# Altium schematic sheet FlashMemory.SchDoc
size A4; SheetNumber: 4; SheetTotal: 11
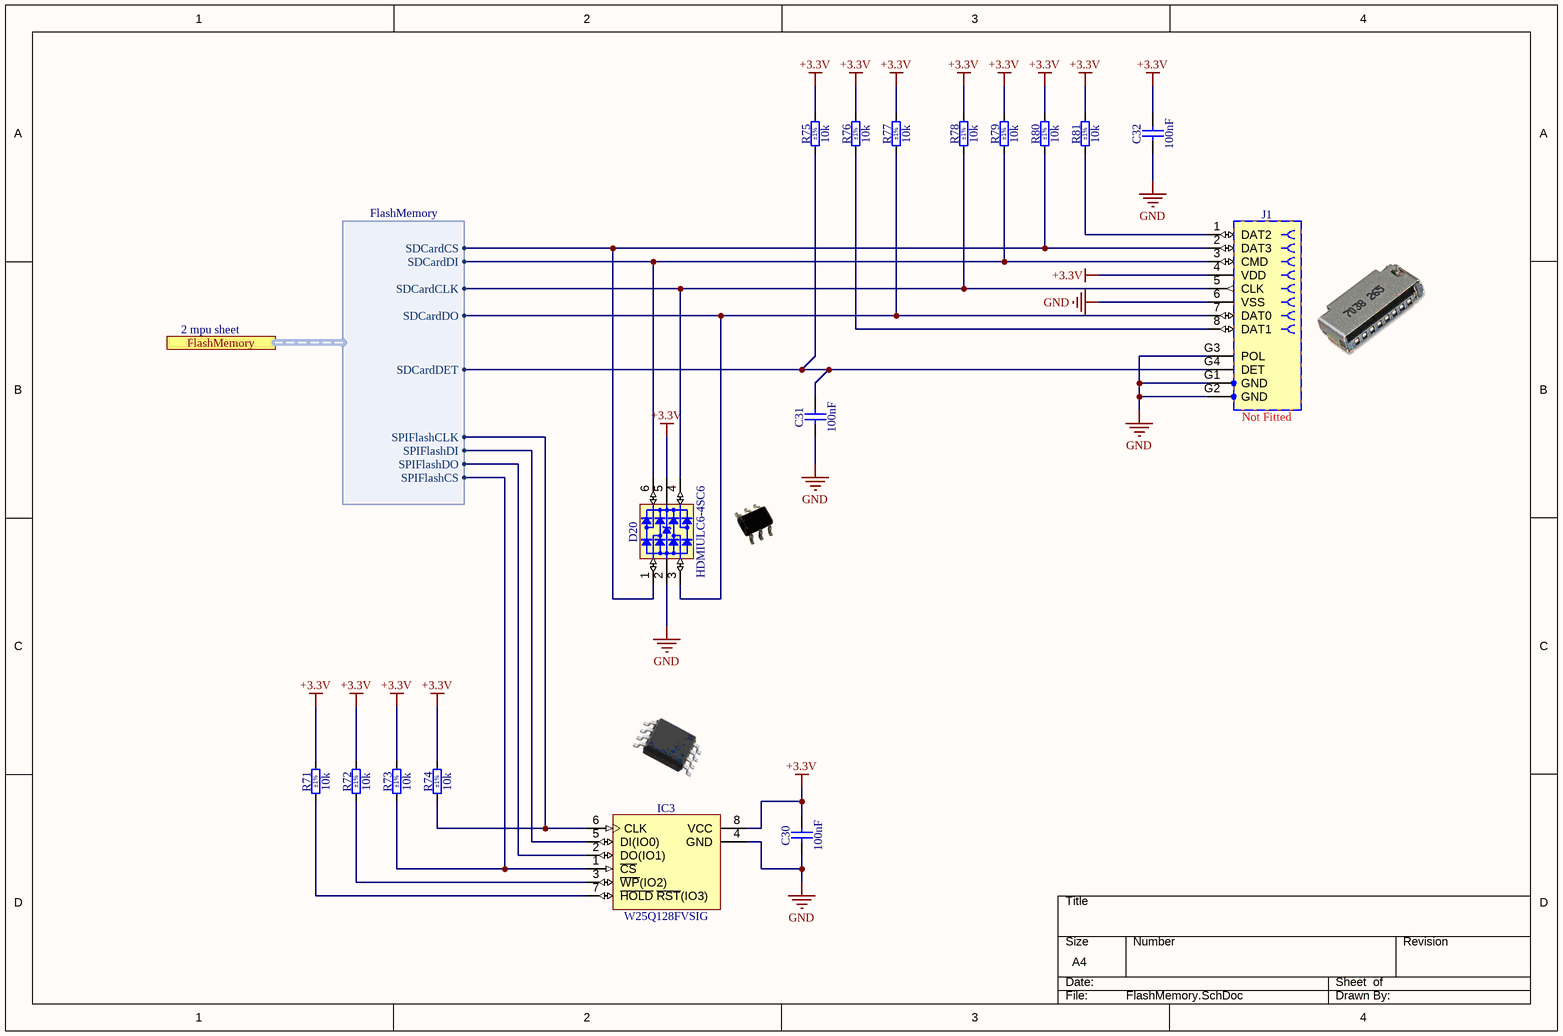
[diagram p0: FlashMemory.SchDoc]

## Parts
C30  100nF  [CAPC1608X87N]
C31  100nF  [CAPC1608X87N]
C32  100nF  [CAPC1608X87N]
D20  HDMIULC6-4SC6  [SOT95P280X145-6N]
IC3  W25Q128FVSIG  [SOIC127P790X216-8N]
J1  Not Fitted  [MOLEX_47309-2651]
R71  10k  Tolerance: ±1%  [RESC1608X55N]
R72  10k  Tolerance: ±1%  [RESC1608X55N]
R73  10k  Tolerance: ±1%  [RESC1608X55N]
R74  10k  Tolerance: ±1%  [RESC1608X55N]
R75  10k  Tolerance: ±1%  [RESC1608X55N]
R76  10k  Tolerance: ±1%  [RESC1608X55N]
R77  10k  Tolerance: ±1%  [RESC1608X55N]
R78  10k  Tolerance: ±1%  [RESC1608X55N]
R79  10k  Tolerance: ±1%  [RESC1608X55N]
R80  10k  Tolerance: ±1%  [RESC1608X55N]
R81  10k  Tolerance: ±1%  [RESC1608X55N]

## Ports
FlashMemory (harness FlashMemory)

## Harnesses
FlashMemory: SDCardDO, SDCardCLK, SDCardDI, SDCardCS, SPIFlashCS, SDCardDET, SPIFlashDO, SPIFlashDI, SPIFlashCLK

## Nets
+3.3V: C30.2 C32.2 D20.5(VBUS) IC3.8(VCC) J1.4(VDD) R71.2 R72.2 R73.2 R74.2 R75.2 R76.2 R77.2 R78.2 R79.2 R80.2 R81.2
GND: C30.1 C31.1 C32.1 D20.2(GND) IC3.4(GND) J1.6(VSS) J1.G1(GND) J1.G2(GND) J1.G3(POL)
NetC31_2: C31.2 J1.G4(DET) R75.1 ; port FlashMemory.SDCardDET
NetD20_1: D20.1(I/O1) J1.2(DAT3) R80.1 ; port FlashMemory.SDCardCS
NetD20_3: D20.3(I/O2) J1.7(DAT0) R77.1 ; port FlashMemory.SDCardDO
NetD20_4: D20.4(I/O3) J1.5(CLK) R78.1 ; port FlashMemory.SDCardCLK
NetD20_6: D20.6(I/O4) J1.3(CMD) R79.1 ; port FlashMemory.SDCardDI
NetIC3_1: IC3.1(~{CS}) R73.1 ; port FlashMemory.SPIFlashCS
NetIC3_2: IC3.2(DO(IO1)) ; port FlashMemory.SPIFlashDO
NetIC3_3: IC3.3(~{WP}(IO2)) R72.1
NetIC3_5: IC3.5(DI(IO0)) ; port FlashMemory.SPIFlashDI
NetIC3_6: IC3.6(CLK) R74.1 ; port FlashMemory.SPIFlashCLK
NetIC3_7: IC3.7(~{HOLD}_~{RST}(IO3)) R71.1
NetJ1_1: J1.1(DAT2) R81.1
NetJ1_8: J1.8(DAT1) R76.1

## Notes on the sheet
- 2 mpu sheet
- THIS DOCUMENT AND THE DATA DISCLOSED HEREIN OR
- HEREWITH IS THE PROPERTY OF ALTIUM LIMITED AND MAY
- DWG NO:
- REVISION
- REV:
- DESCRIPTION
- DATE
- APPROVED
- BE FREELY DISTRIBUTED IN WHOLE. NO RIGHTS ARE
- RESERVED OR EXPRESS OR IMPLIED WARANTEE GIVEN.
- ENG:
- APPROVALS
- PROJECT
- DSN:
- CHK:
- REFERENCE DOCUMENTS
- PROJECT REVISION:
- TITLE
- DOCUMENT REVISION:
- DESIGN ITEM:
- BOM:
- FAB DWG:
- PCB DWG:
- ASSY DWG:
- SCALE:
- A3
- SIZE
- CAGE CODE
- FILE NAME
- DWG NO.
- SHEET
- OF
- REV

## Library data of the parts
C30-C32 = CC0603_100NF_50V_10%_X7R: Non-polarised capacitor; Part Description: SMD Multilayer Chip Ceramic Capacitor; Manufacturer: GENERIC; Manufacturer1 Part Number: 223858615649; Voltage: 50V; TC: X7R; Tolerance: ±10%; Part Number: CC0603_100NF_50V_10%_X7R; Component Kind: Standard; Component Type: Standard; Pin Count: 2; Value: 100nF; Status: Preferred; Manufacturer Part Number: CC0603_100NF_50V_10%_X7R; Case: 0603; Mounted: Yes; Socket: No; SMD: Yes; Sense: No; Manufacturer1 Example: PHYCOMP; Manufacturer1 ComponentHeight: 0.87mm; HelpURL: \\cern.ch\dfs\Applications\Altium\Datasheets\CC0603_X7R_PHYCOMP.pdf; Author: CERN DEM JLC; CreateDate: 03.12.2007; LatestRevisionDate: 03.12.2007
D20 = HDMIULC6-4SC6: Ultra Large Bandwidth HDMI ESD Protection; Part Description: Ultra Large Bandwidth HDMI ESD (15kV) Protection; Manufacturer: ST MICROELECTRONICS; Voltage: 6V; PressFit: No; Bonding: No; Part Number: HDMIULC6-4SC6; Component Kind: Standard; Component Type: Standard; Device: HDMIULC6-4SC6; PackageDescription: SOT, 0.95mm Pitch; 6 Pin, 1.60mm W X 3.00mm L X 1.45mm H body, IPC Medium Density; Manufacturer Part Number: HDMIULC6-4SC6; Pin Count: 6; Case: SOT23-6; Mounted: Yes; Socket: No; SMD: Yes; Sense: No; ComponentHeight: 1.45mm; HelpURL: \\cern.ch\dfs\Applications\Altium\Datasheets\HDMIULC6-4SC6.pdf; Author: CERN DEM JLC; CreateDate: 04.06.2012; LatestRevisionDate: 03.07.2012
IC3 = W25Q128FVSIG: 128M-bit Serial Flash Memory with uniform 4KB sectors and Dual/Quad SPI and QPI; Manufacturer: WINBOND; PressFit: No; Bonding: No; Part Number: W25Q128FVSIG; Component Kind: Standard; Component Type: Standard; Device: W25Q128FVSIG; PackageDescription: SOIC, 1.27mm Pitch; 8 Pin, 5.285mm W X 5.335mm L X 2.16mm H body, IPC Medium Density; Part Description: 128M-bit Serial Flash Memory with uniform 4KB sectors and Dual/Quad SPI and QPI; Manufacturer Part Number: W25Q128FVSIG; Pin Count: 8; Case: SOIC8; Mounted: Yes; Socket: No; SMD: Yes; Sense: No; ComponentHeight: 2.16mm; HelpURL: \\cern.ch\dfs\Applications\Altium\Datasheets\W25Q128FVSIG.pdf; Author: CERN DEM MR; CreateDate: 26.01.2018; LatestRevisionDate: 26.01.2018
J1 = MOLEX_47309-2651: MicroSD Card Header with Detect Switch; Part Description: 1.10mm Pitch microSD Card Header with Detect Switch; Manufacturer: MOLEX; PressFit: No; Part Number: MOLEX_47309-2651; Component Kind: Standard; Component Type: Standard; Pin Count: 12; Family: microSD; Mounted: Yes; Socket: No; SMD: Yes; Sense: No; Status: None; Manufacturer Part Number: 47309-2651; ComponentHeight: 2.65mm; HelpURL: \\cern.ch\dfs\Applications\Altium\Datasheets\MOLEX_47309-2651.pdf; Author: CERN DEM JMW; CreateDate: 29.06.2017; LatestRevisionDate: 29.06.2017
R71-R81 = R0603_10K_1%_0.1W_100PPM: Resistor - 1%; Part Description: General Purpose Thick Film Chip Resistor; Manufacturer: GENERIC; Manufacturer1 Part Number: NRC06F1002TRF; Power: 0.1W; TC: ±100ppm/°C; PressFit: No; Part Number: R0603_10K_1%_0.1W_100PPM; Component Kind: Standard; Component Type: Standard; Pin Count: 2; Value: 10k; Status: Preferred; Manufacturer Part Number: R0603_10K_1%_0.1W_100PPM; Case: 0603; Mounted: Yes; Sense: No; Socket: No; SMD: Yes; Manufacturer1 Example: NIC COMPONENT; Manufacturer1 ComponentHeight: 0.55mm; HelpURL: \\cern.ch\dfs\Applications\Altium\Datasheets\R0603_NIC_NRC.pdf; Author: CERN DEM JLC; CreateDate: 03.12.2007; LatestRevisionDate: 13.03.2008